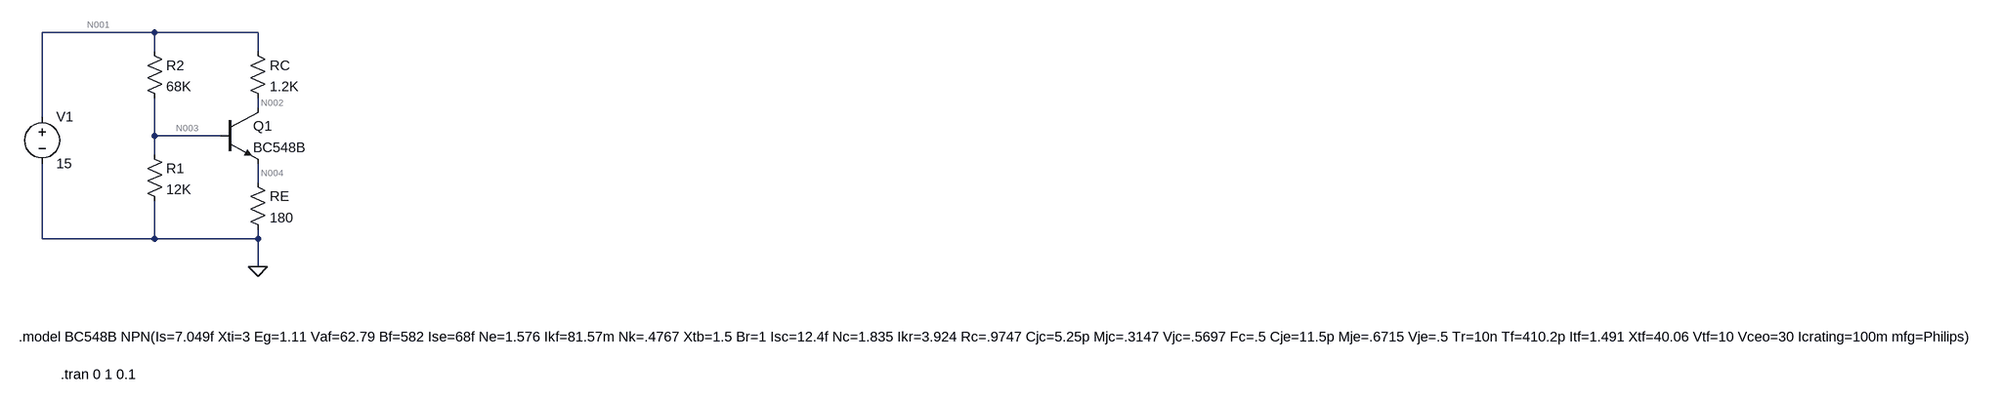
[diagram p0: schematic Sim_Norm.asc]
Sim_Norm.asc, the LTspice schematic file:
Version 4.1
SHEET 1 3988 792
WIRE 496 192 304 192
WIRE 672 192 496 192
WIRE 496 224 496 192
WIRE 672 224 672 192
WIRE 672 320 672 304
WIRE 304 336 304 192
WIRE 496 368 496 304
WIRE 608 368 496 368
WIRE 496 400 496 368
WIRE 672 448 672 416
WIRE 304 544 304 416
WIRE 496 544 496 480
WIRE 496 544 304 544
WIRE 672 544 672 528
WIRE 672 544 496 544
WIRE 672 592 672 544
FLAG 672 592 0
DATAFLAG 672 304 "$-V(N004)"
DATAFLAG 672 304 ""
SYMBOL voltage 304 320 R0
SYMATTR InstName V1
SYMATTR Value 15
SYMBOL res 480 384 R0
SYMATTR InstName R1
SYMATTR Value 12K
SYMBOL res 480 208 R0
SYMATTR InstName R2
SYMATTR Value 68K
SYMBOL res 656 208 R0
SYMATTR InstName RC
SYMATTR Value 1.2K
SYMBOL res 656 432 R0
SYMATTR InstName RE
SYMATTR Value 180
SYMBOL npn 608 320 R0
SYMATTR InstName Q1
SYMATTR Value BC548B
TEXT 264 712 Left 2 !.model BC548B NPN(Is=7.049f Xti=3 Eg=1.11 Vaf=62.79 Bf=582 Ise=68f Ne=1.576 Ikf=81.57m Nk=.4767 Xtb=1.5 Br=1 Isc=12.4f Nc=1.835 Ikr=3.924 Rc=.9747 Cjc=5.25p Mjc=.3147 Vjc=.5697 Fc=.5 Cje=11.5p Mje=.6715 Vje=.5 Tr=10n Tf=410.2p Itf=1.491 Xtf=40.06 Vtf=10 Vceo=30 Icrating=100m mfg=Philips)
TEXT 336 776 Left 2 !.tran 0 1 0.1

The netlist it stands for:
* Sim_Norm.asc
V1 N001 0 15
R1 N003 0 12K
R2 N001 N003 68K
RC N001 N002 1.2K
RE N004 0 180
Q1 N002 N003 N004 0 BC548B
.model NPN NPN
.model PNP PNP
.lib standard.bjt
.model BC548B NPN(Is=7.049f Xti=3 Eg=1.11 Vaf=62.79 Bf=582 Ise=68f Ne=1.576 Ikf=81.57m Nk=.4767 Xtb=1.5 Br=1 Isc=12.4f Nc=1.835 Ikr=3.924 Rc=.9747 Cjc=5.25p Mjc=.3147 Vjc=.5697 Fc=.5 Cje=11.5p Mje=.6715 Vje=.5 Tr=10n Tf=410.2p Itf=1.491 Xtf=40.06 Vtf=10 Vceo=30 Icrating=100m mfg=Philips)
.tran 0 1 0.1
.backanno
.end

* Results of the author's LTspice run, read from the files saved beside the schematic
* Operating Point, zero values left out:
*   V(n003) = 2.084 V
*   V(n004) = 1.367 V
*   V(n001) = 15 V
*   V(n002) = 5.906 V
*   I(V1) = -7.768 mA
*   I(R2) = 189.9 µA
*   I(RE) = 7.595 mA
*   Ic(Q1) = 7.579 mA
*   Ib(Q1) = 16.26 µA
*   Ie(Q1) = -7.595 mA
*   I(R1) = 173.7 µA
*   I(RC) = 7.579 mA